# EasyEDA Pro project 25集创赛海云捷讯杯.epro, board PCB1_2
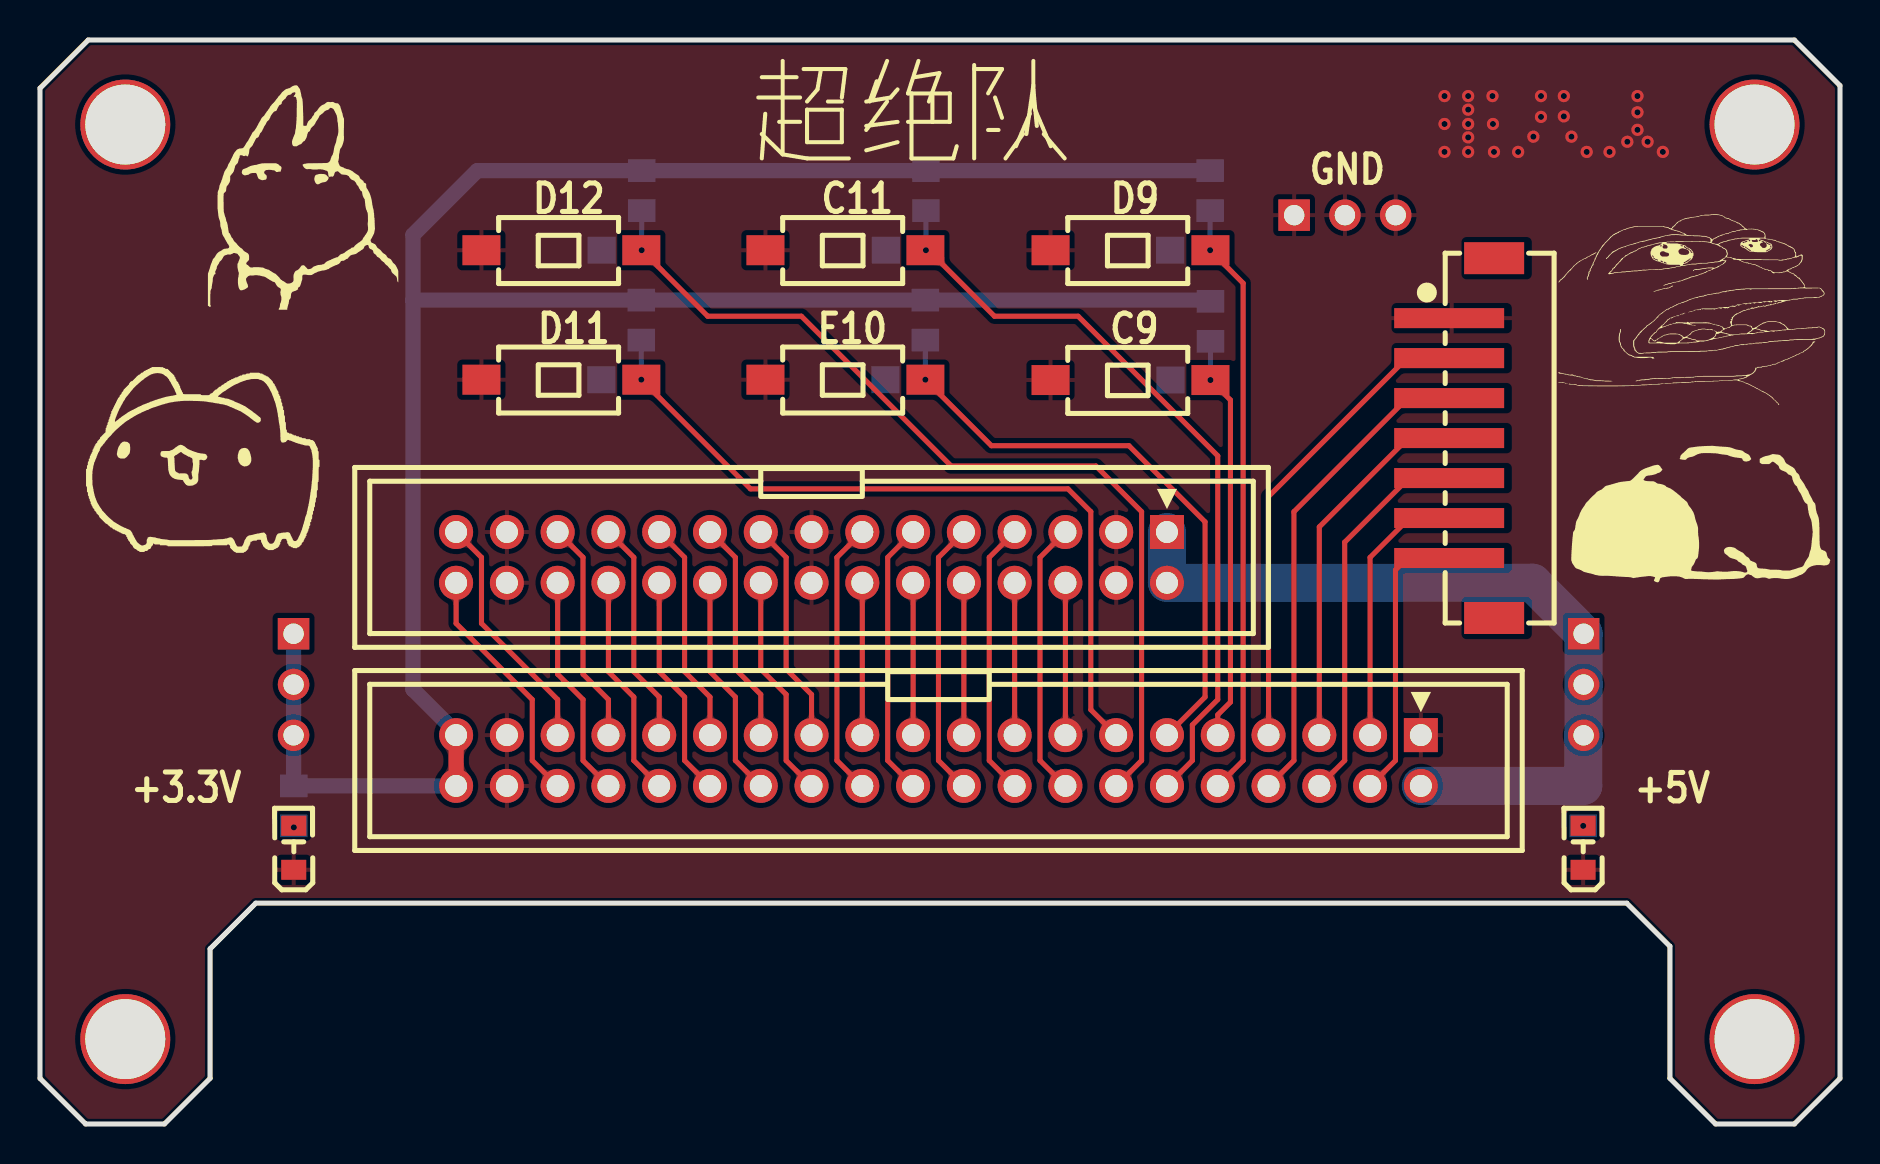
[diagram p14: board, top side]
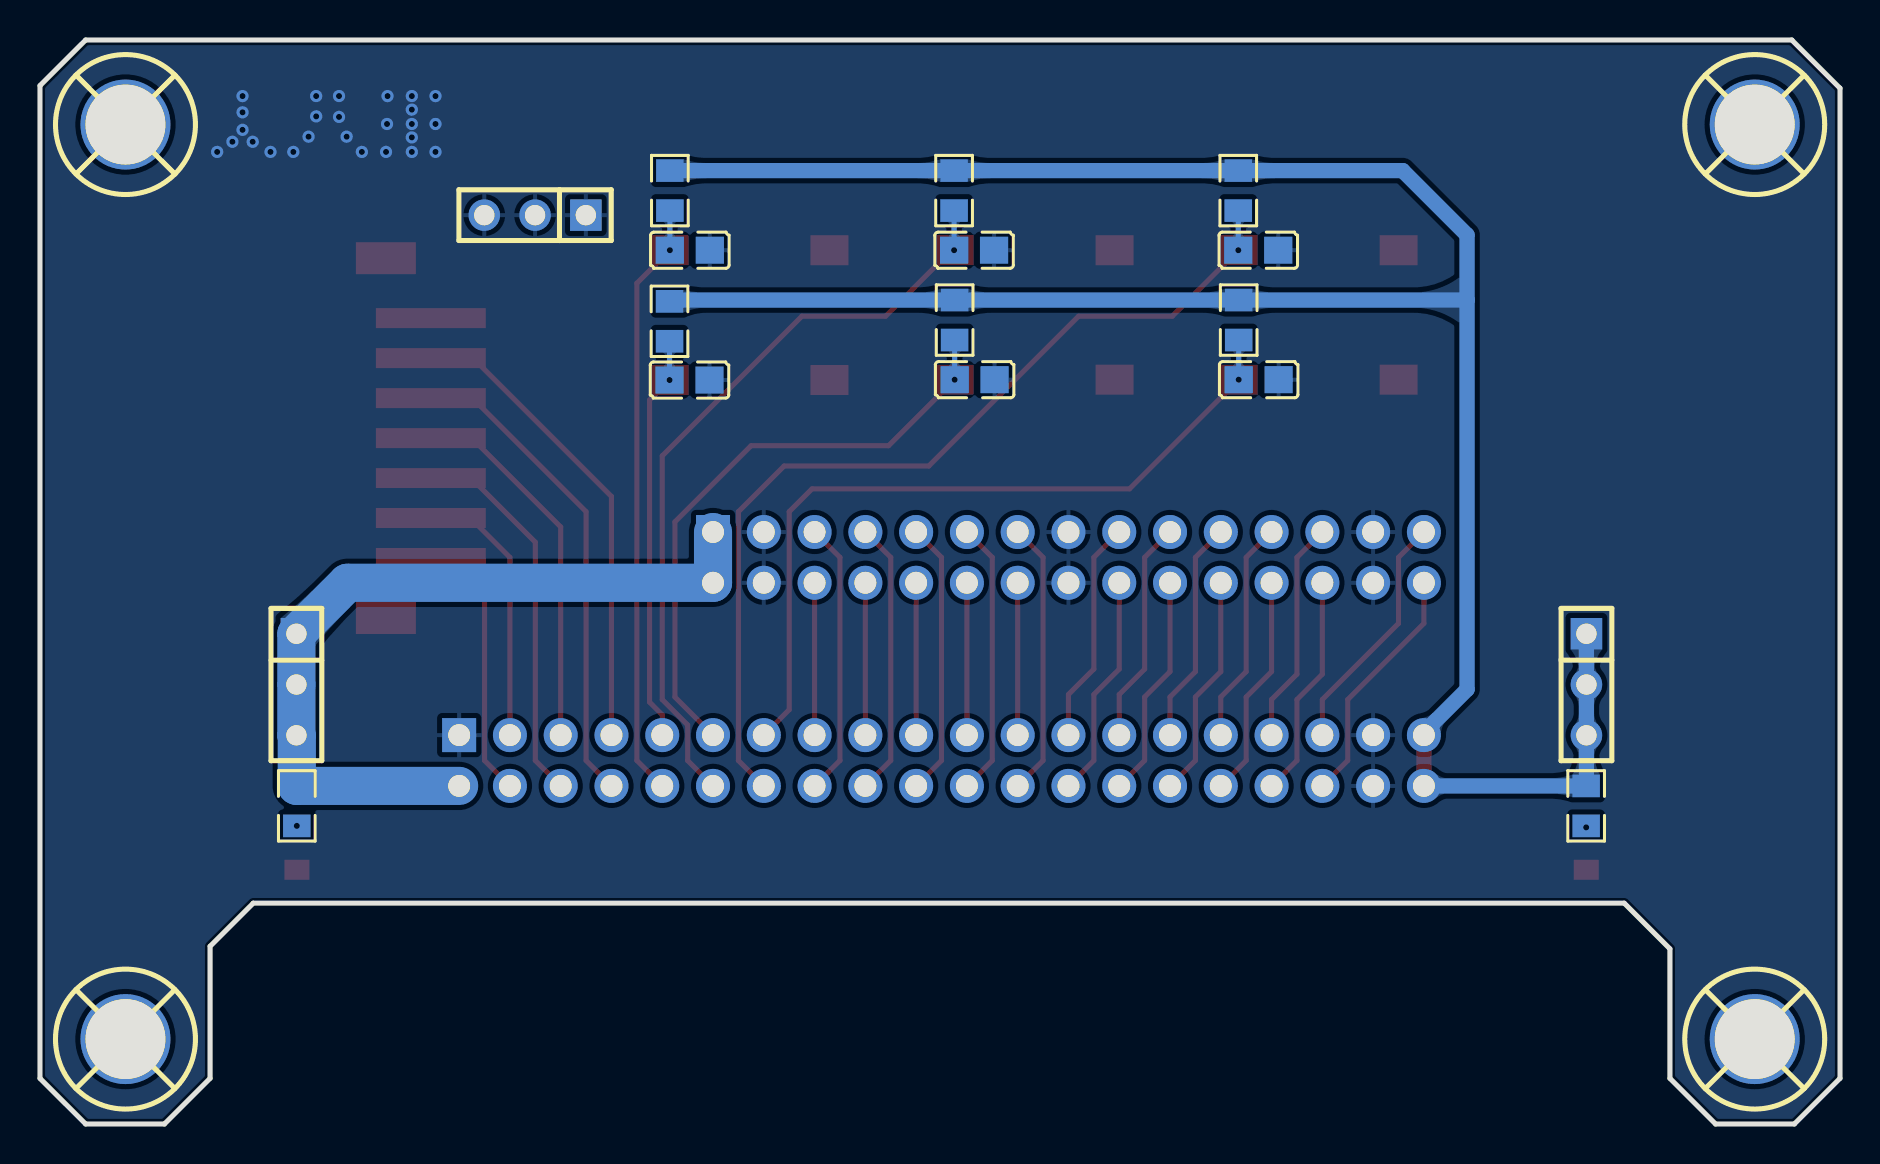
[diagram p15: board, bottom side, seen from below]

Outline 90.04 x 54.23 mm; copper layers: Top Layer, Bottom Layer. Coordinates in mm from the lower left corner of the outline.
Outline path: 0,51.82 0,2.29 2.29,0 6.22,0 8.51,2.29 8.51,8.76 10.8,11.05 79.38,11.05 81.53,8.89 81.53,2.29 83.82,0 87.76,0 90.04,2.29 90.04,51.94 87.76,54.23 2.41,54.23 0,51.82
Stack: Top Layer 0.035mm / Dielectric1 1.51mm FR4 er 4.5 / Bottom Layer 0.035mm

## Design rules (mm)
spacing copperThickness1oz (default): track to track 0.102, other pairs 0.152 to 0.3
spacing copperThickness2oz: track to track 0.203, other pairs 0.152 to 0.3
spacing Plane_innerPlane: track to track 0.102, other pairs 0.152 to 0.3
spacing Copper_copperRegion: track to track 0.102, other pairs 0.152 to 0.3
track width copperThickness1oz (default): min 0.127, default 0.254, max 2.54
track width copperThickness2oz: min 0.203, default 0.254, max 2.54
differential pair differentialPair (default): width min 0.127, default 0.254, max 2.54; gap min 0.152, default 0.152
pour e189 uses Copper_copperRegion
pour e257 uses Copper_copperRegion

## Placement (name value [footprint] x y rotation side)
C29  104  [c0805]  29.1 43.71 180 bottom
C30  104  [c0805]  43.32 43.71 180 bottom
C31  104  [c0805]  57.53 43.71 180 bottom
C32  104  [c0805]  29.08 37.24 180 bottom
C68  104  [c0805]  43.29 37.24 180 bottom
C69  104  [c0805]  57.55 37.22 180 bottom
H2  -  [HDR-TH_3P-P2.54-V-F]  65.28 45.47 0 bottom
H4  -  [HDR-TH_3P-P2.54-V-F]  77.22 21.99 270 bottom
H5  -  [HDR-TH_3P-P2.54-V-F]  12.69 21.99 270 bottom
LED3  -  [LED_0805]  77.2 13.87 90 top
LED4  -  [LED_0805]  12.7 13.87 90 top
R9  10K  [R0805]  77.2 15.92 270 bottom
R11  10K  [R0805]  30.1 46.7 90 bottom
R12  10K  [R0805]  44.32 46.7 90 bottom
R13  10K  [R0805]  58.53 46.7 90 bottom
R14  10K  [R0805]  30.08 40.22 90 bottom
R15  10K  [R0805]  12.7 15.92 270 bottom
R16  10K  [R0805]  44.29 40.22 90 bottom
R17  10K  [R0805]  58.55 40.16 90 bottom
SCREW1  -  [M4螺丝]  4.27 50 0 bottom
SCREW2  -  [M4螺丝]  4.27 4.25 0 bottom
SCREW3  -  [M4螺丝]  85.77 4.25 0 bottom
SCREW4  -  [M4螺丝]  85.77 50 0 bottom
SW3  TS-1101-C-W  [SW-SMD_L6.0-W3.3-LS8.0]  26.08 43.71 0 top
SW4  TS-1101-C-W  [SW-SMD_L6.0-W3.3-LS8.0]  40.29 43.71 0 top
SW5  TS-1101-C-W  [SW-SMD_L6.0-W3.3-LS8.0]  54.55 43.71 0 top
SW6  TS-1101-C-W  [SW-SMD_L6.0-W3.3-LS8.0]  26.08 37.24 0 top
SW7  TS-1101-C-W  [SW-SMD_L6.0-W3.3-LS8.0]  40.29 37.24 0 top
SW8  TS-1101-C-W  [SW-SMD_L6.0-W3.3-LS8.0]  54.55 37.22 0 top
U3  BX-PH2.0-7PLT  [CONN-SMD_7P-P2.00_WAFER-200L-7P]  71.62 34.31 270 top
U5  XDFH-0254-2*15P  [CONN-TH_30P-P2.54_LX_XDFH-0254-2X15P]  38.6 28.35 180 top
U7  XDFH-0254-2*20P  [CONN-TH_40P-P2.54_LX_XDFH-0254-2X20P]  44.95 18.19 180 top

## Footprints (pads in the part's own frame, mm; a bottom-side part is the same pattern mirrored in y, then rotated)
c0805
  rect 1.41x1.35 smd: 1(-1,0) 2(1,0)
CONN-SMD_7P-P2.00_WAFER-200L-7P
  rect 1x5.5 smd: 1(-6,-1.125) 2(-4,-1.125) 3(-2,-1.125) 4(0,-1.125) 5(2,-1.125) 6(4,-1.125) 7(6,-1.125)
  rect 1.6x3 smd: 8(-9,1.125) 9(9,1.125)
CONN-TH_30P-P2.54_LX_XDFH-0254-2X15P
  rect 1.7x1.7 hole 1.1: 1(-17.78,-1.27)
  round 1.7 hole 1.1: 2(-17.78,1.27) 3(-15.24,-1.27) 4(-15.24,1.27) 5(-12.7,-1.27) 6(-12.7,1.27) 7(-10.16,-1.27) 8(-10.16,1.27) 9(-7.62,-1.27) 10(-7.62,1.27) 11(-5.08,-1.27) 12(-5.08,1.27) 13(-2.54,-1.27) 14(-2.54,1.27) 15(0,-1.27) 16(0,1.27) 17(2.54,-1.27) 18(2.54,1.27) 19(5.08,-1.27) 20(5.08,1.27) 21(7.62,-1.27) 22(7.62,1.27) 23(10.16,-1.27) 24(10.16,1.27) 25(12.7,-1.27) 26(12.7,1.27) 27(15.24,-1.27) 28(15.24,1.27) 29(17.78,-1.27) 30(17.78,1.27)
CONN-TH_40P-P2.54_LX_XDFH-0254-2X20P
  rect 1.7x1.7 hole 1.1: 1(-24.13,-1.27)
  round 1.7 hole 1.1: 2(-24.13,1.27) 3(-21.59,-1.27) 4(-21.59,1.27) 5(-19.05,-1.27) 6(-19.05,1.27) 7(-16.51,-1.27) 8(-16.51,1.27) 9(-13.97,-1.27) 10(-13.97,1.27) 11(-11.43,-1.27) 12(-11.43,1.27) 13(-8.89,-1.27) 14(-8.89,1.27) 15(-6.35,-1.27) 16(-6.35,1.27) 17(-3.81,-1.27) 18(-3.81,1.27) 19(-1.27,-1.27) 20(-1.27,1.27) 21(1.27,-1.27) 22(1.27,1.27) 23(3.81,-1.27) 24(3.81,1.27) 25(6.35,-1.27) 26(6.35,1.27) 27(8.89,-1.27) 28(8.89,1.27) 29(11.43,-1.27) 30(11.43,1.27) 31(13.97,-1.27) 32(13.97,1.27) 33(16.51,-1.27) 34(16.51,1.27) 35(19.05,-1.27) 36(19.05,1.27) 37(21.59,-1.27) 38(21.59,1.27) 39(24.13,-1.27) 40(24.13,1.27)
HDR-TH_3P-P2.54-V-F
  rect 1.575x1.575 hole 1.02: 1(-2.54,0)
  round 1.575 hole 1.02: 2(0,0) 3(2.54,0)
LED_0805
  rect 1x1.25 smd: 1(-1.15,0.005) 2(1.05,0.005)
M4螺丝
  round 4.5 hole 4: 1(0,0)
R0805
  rect 1.133x1.377 smd: 1(-1,0) 2(1,0)
SW-SMD_L6.0-W3.3-LS8.0
  rect 1.9x1.5 smd: 1(-4,0) 2(4,0)

## Nets
+3.3V: H5.1 H5.2 H5.3 R11.2 R12.2 R13.2 R14.2 R15.1 R16.2 R17.2 U7.39 U7.40
+5V: H4.1 H4.2 H4.3 R9.1 U5.1 U5.2 U7.2
GND: C29.2 C30.2 C31.2 C32.2 C68.2 C69.2 H2.1 H2.2 H2.3 LED3.1 LED4.1 SW3.1 SW4.1 SW5.1 SW6.1 SW7.1 SW8.1 U3.1 U5.3 U5.4 U5.15 U5.16 U5.27 U5.28 U7.1 U7.37 U7.38
AIR_PUMP: U3.7 U7.4
B14_L10_N: U5.30 U7.36
B14_L10_P: U5.29 U7.35
B15_L4_N: U5.22 U7.30
B15_L4_P: U5.21 U7.29
B15_L9_N: U5.26 U7.34
B15_L9_P: U5.25 U7.33
B15_L10_N: U5.6 U7.15
B15_L10_P: U5.5 U7.16
B15_L14_N: U5.8 U7.17
B15_L14_P: U5.7 U7.18
B15_L16_N: U5.10 U7.19
B15_L16_P: U5.9 U7.20
B15_L17_N: U5.12 U7.21
B15_L17_P: U5.11 U7.22
B15_L19_N: U5.20 U7.28
B15_L19_P: U5.19 U7.27
B15_L20_N: U5.24 U7.32
B15_L20_P: U5.23 U7.31
B15_L22_N: U5.14 U7.23
B15_L22_P: U5.13 U7.24
B15_L24_N: U5.18 U7.26
B15_L24_P: U5.17 U7.25
C9: C69.1 R17.1 SW8.2 U7.9
C11: C30.1 R12.1 SW4.2 U7.12
D9: C31.1 R13.1 SW5.2 U7.10
D11: C32.1 R14.1 SW6.2 U7.13
D12: C29.1 R11.1 SW3.2 U7.14
E7: U3.6 U7.3
E8: U3.4 U7.5
E9: U3.3 U7.8
E10: C68.1 R16.1 SW7.2 U7.11
F7: U3.5 U7.6
F9: U3.2 U7.7
$1N2036: LED3.2 R9.2
$1N2039: LED4.2 R15.2

Pads without a net: SCREW1 1; SCREW2 1; SCREW3 1; SCREW4 1; U3 8 9

## Via types
v1: diameter 0.61, hole 0.305, Top Layer to Bottom Layer, 34 vias

## Routing (per net, layer and track width the routed paths; a pad name or vN(x,y) marks a point on that pad's centre or on a via; arc(x,y) is an arc through that point)
+3.3V: length 125.3
  Top Layer w0.762: U7.39 U7.40
  Bottom Layer w0.762: R13.2 R12.2 R11.2 21.88,47.7 18.66,44.47 18.66,41.21 ; U7.39 20.82,19.58 18.66,21.74 18.66,41.21 ; H5.1 H5.2 H5.3 12.69,16.93 R15.1 U7.40 ; R17.2 58.49,41.22 R16.2 R14.2 18.66,41.22 18.66,41.21
+5V: length 40.2
  Bottom Layer w1.905: U7.2 R9.1 77.2,19.43 H4.3 H4.2 H4.1 74.67,27.08 U5.2 U5.1
GND:
  vias: v1(70.26,51.42) v1(70.26,50.03) v1(70.26,48.63) v1(71.44,51.42) v1(71.44,50.74) v1(71.44,50.03) v1(71.44,49.36) v1(71.44,48.63) v1(72.66,51.42) v1(72.68,50.03) v1(72.73,48.63) v1(73.94,48.63) v1(74.7,49.39) v1(75.08,51.42) v1(75.08,50.38) v1(76.23,51.42) v1(76.23,50.41) v1(76.61,49.39) v1(77.37,48.63) v1(78.51,48.63) v1(79.4,49.14) v1(79.91,51.42) v1(79.91,50.61) v1(79.91,49.73) v1(80.42,49.14) v1(81.18,48.63)
AIR_PUMP: length 14.4
  Top Layer w0.254: 70.62,28.31 68.41,28.31 67.81,27.71 67.81,18.19 U7.4
B14_L10_N: length 12.3
  Top Layer w0.254: U5.30 20.82,25.04 24.63,21.23 24.63,18.19 U7.36
B14_L10_P: length 12.3
  Top Layer w0.254: U7.35 25.9,21.23 22.09,25.04 22.09,28.35 U5.29
B15_L4_N: length 11.2
  Top Layer w0.254: U5.22 30.98,22.63 32.25,21.36 32.25,18.19 U7.30
B15_L4_P: length 11.2
  Top Layer w0.254: U7.29 33.52,21.36 32.25,22.63 32.25,28.35 U5.21
B15_L9_N: length 11.2
  Top Layer w0.254: U7.34 27.17,18.19 27.17,21.23 25.9,22.5 U5.26
B15_L9_P: length 11.2
  Top Layer w0.254: U7.33 28.44,21.23 27.17,22.5 27.17,28.35 U5.25
B15_L10_N: length 7.6
  Top Layer w0.254: U5.6 U7.15
B15_L10_P: length 13.8
  Top Layer w0.254: U7.16 50.03,18.19 50.03,28.35 U5.5
B15_L14_N: length 7.6
  Top Layer w0.254: U5.8 U7.17
B15_L14_P: length 13.8
  Top Layer w0.254: U5.7 47.49,28.35 47.49,18.19 U7.18
B15_L16_N: length 7.6
  Top Layer w0.254: U5.10 U7.19
B15_L16_P: length 13.8
  Top Layer w0.254: U5.9 44.95,28.35 44.95,18.19 U7.20
B15_L17_N: length 7.6
  Top Layer w0.254: U5.12 U7.21
B15_L17_P: length 13.8
  Top Layer w0.254: U7.22 42.41,18.19 42.41,28.35 U5.11
B15_L19_N: length 11.2
  Top Layer w0.254: U7.28 34.79,18.19 34.79,21.36 33.52,22.63 U5.20
B15_L19_P: length 11.2
  Top Layer w0.254: U7.27 36.06,21.49 34.79,22.76 34.79,28.35 U5.19
B15_L20_N: length 11.2
  Top Layer w0.254: U5.24 28.44,22.63 29.71,21.36 29.71,18.19 U7.32
B15_L20_P: length 11.2
  Top Layer w0.254: U7.31 30.98,21.36 29.71,22.63 29.71,28.35 U5.23
B15_L22_N: length 7.6
  Top Layer w0.254: U5.14 U7.23
B15_L22_P: length 13.8
  Top Layer w0.254: U7.24 39.87,18.19 39.87,28.35 U5.13
B15_L24_N: length 11.2
  Top Layer w0.254: U7.26 37.33,18.19 37.33,21.49 36.06,22.76 U5.18
B15_L24_P: length 11.2
  Top Layer w0.254: U7.25 38.6,21.49 37.33,22.76 37.33,28.35 U5.17
C9: length 20.4
  Top Layer w0.254: U7.9 58.92,20.47 59.55,21.11 59.55,36.22 v1(58.55,37.22)
  Bottom Layer w0.254: R17.1 v1(58.55,37.22)
C11: length 38.4
  Top Layer w0.254: v1(44.32,43.71) 44.44,43.71 47.75,40.41 51.93,40.41 58.92,33.43 58.92,21.23 57.65,19.96 57.65,18.19 U7.12
  Bottom Layer w0.254: R12.1 v1(44.32,43.71)
D9: length 30
  Top Layer w0.254: v1(58.53,43.71) 60.19,42.06 60.19,18.19 U7.10
  Bottom Layer w0.254: R13.1 v1(58.54,43.71)
D11: length 38.9
  Top Layer w0.254: U7.13 52.57,20.73 52.57,30.63 51.42,31.77 35.54,31.77 v1(30.08,37.24)
  Bottom Layer w0.254: v1(30.08,37.24) R14.1
D12: length 46.6
  Top Layer w0.254: U7.14 55.11,18.19 55.11,30.63 52.82,32.92 45.58,32.92 38.09,40.41 33.4,40.41 v1(30.1,43.71)
  Bottom Layer w0.254: C29.1 R11.1
E7: length 13.8
  Top Layer w0.254: 70.62,30.31 68.5,30.31 66.54,28.35 U7.3
E8: length 18.9
  Top Layer w0.254: 70.62,34.31 68.44,34.31 64,29.87 U7.5
E9: length 24.5
  Top Layer w0.254: U7.8 62.73,18.19 62.73,30.63 68.41,36.31 70.62,36.31
E10: length 30.3
  Top Layer w0.254: v1(44.29,37.24) 47.59,33.93 54.47,33.93 58.28,30.12 58.28,21.36 U7.11
  Bottom Layer w0.254: 44.29,37.24 44.29,39.19
F7: length 19.4
  Top Layer w0.254: U7.6 65.27,18.19 65.27,29.11 68.47,32.31 70.62,32.31
F9: length 24
  Top Layer w0.254: U7.7 61.46,31.39 68.38,38.31 70.62,38.31
$1N2036:
  vias: v1(77.2,14.92)
$1N2039:
  vias: v1(12.7,14.84)

## Copper pours and planes (outline as drawn; the poured copper is in the pictures)
GND on Top Layer: -1.38,63.01 103.01,63.01 103.01,-1.12 -1.38,-1.12
GND on Bottom Layer: -2.65,55.77 92.98,55.77 92.98,-3.16 -2.65,-3.16

Small or netless copper shapes (teardrops, artwork), in the pictures only: 68 on Top Layer, 39 on Bottom Layer

## Text on the board
Top Silkscreen Layer: +3.3V | D12 | D11 | E10 | C11 | C9 | D9 | GND | +5V | 超绝队
